# Altium schematic sheet Analog Input Conditioning.SchDoc
size A; SheetNumber: 3; SheetTotal: 7
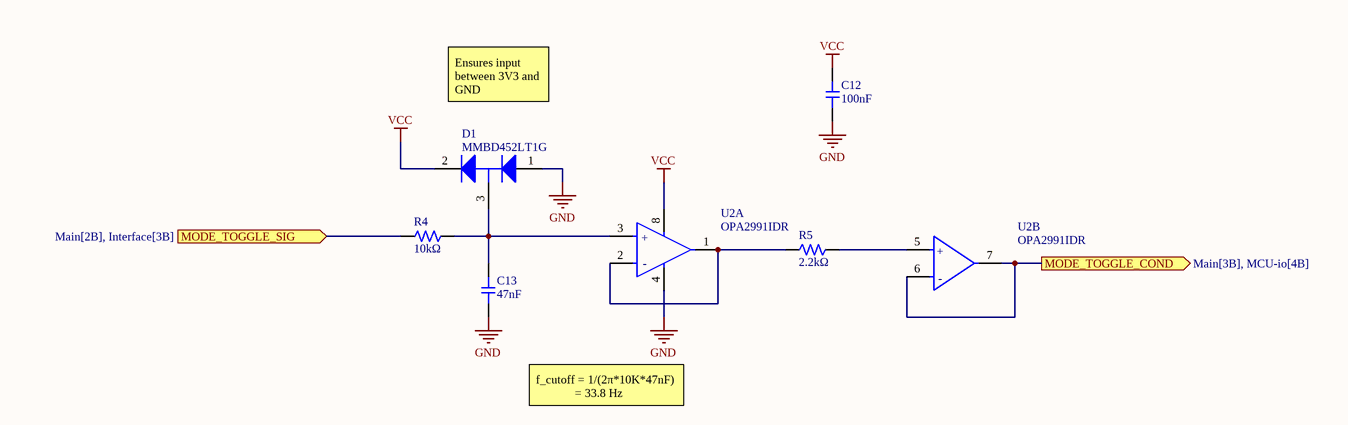
[diagram p0: Analog Input Conditioning.SchDoc]

## Parts
C12  Capacitance: 100nF  [CAP-0603]  (hidden comment: CC0603KRX7R9BB104)
C13  Capacitance: 47nF  [CAP-0603]  (hidden comment: CL10B473KB8NNNC)
D1  MMBD452LT1G  [ONSC-SOT-23-3-318-08_V]
R4  Resistance: 10kΩ  [RES-0603]  (hidden comment: 0603WAF1002T5E)
R5  Resistance: 2.2kΩ  [RES-0603]  (hidden comment: 0603WAF2201T5E)
U2  OPA2991IDR  [FP-D0008A-IPC_C]  (parts A,B of 2)

## Ports
MODE_TOGGLE_COND (out, see Main[3B], MCU-io[4B]), MODE_TOGGLE_SIG (in, see Main[2B], Interface[3B])

## Nets
GND: C12.1 C13.1 D1.1(A) U2.4(V-)
VCC: C12.2 D1.2(K) U2.8(V+)
MODE_TOGGLE_COND: U2.6(IN2-) U2.7(OUT2) ; port MODE_TOGGLE_COND
MODE_TOGGLE_SIG: R4.1 ; port MODE_TOGGLE_SIG
NetC13_2: C13.2 D1.3(K/A) R4.2 U2.3(IN1+)
NetR5_1: R5.1 U2.1(OUT1) U2.2(IN1-)
NetR5_2: R5.2 U2.5(IN2+)

## Notes on the sheet
- Ensures input between 3V3 and GND
- f_cutoff = 1/(2π*10K*47nF)
  = 33.8 Hz
- (in symbol OPA2991IDR, part A) +; -
- (in symbol OPA2991IDR, part B) +; -

## Library data of the parts
C12 = CC0603KRX7R9BB104: Capacitor, Ceramic (MLCC), 100nF, ±10%, 50V, X7R, ±10%, SMD 0603; Manufacturer: YAGEO; Package Size: 0603; JLCPCB Basic Part: Yes; JLCPCB Part Number: C14663; Supplier 1: LCSC; Category: Capacitors - MLCC; Supplier Part Number 1: C14663; Manufacturer Part Number: CC0603KRX7R9BB104; Tolerance: ±10%; Voltage Rating: 50V; Temperature Coefficient: X7R; RoHS: Yes; ComponentLink1Description: Datasheet; ComponentLink1URL: https://wmsc.lcsc.com/wmsc/upload/file/pdf/v2/lcsc/2211101700_YAGEO-CC0603KRX7R9BB104_C14663.pdf; ComponentLink2Description: JLCPCB Part URL; ComponentLink2URL: https://jlcpcb.com/partdetail/C14663; ComponentLink3Description: LCSC Part URL; ComponentLink3URL: https://lcsc.com/product-detail/Multilayer-Ceramic-Capacitors-MLCC---SMD-SMT_YAGEO-YAGEO-CC0603KRX7R9BB104_C14663.html
C13 = CL10B473KB8NNNC: Capacitor, Ceramic (MLCC), 47nF, ±10%, 50V, X7R, ±10%, SMD 0603; Manufacturer: Samsung Electro-Mechanics; Temperature Rating: -55°C ~ 125°C; Capacitance @ 1V DC Bias: 47.231nF; Capacitance @ 1.2V DC Bias: 47.280nF; Capacitance @ 1.35V DC Bias: 47.319nF; Capacitance @ 1.5V DC Bias: 47.357nF; Capacitance @ 1.8V DC Bias: 47.426nF; Capacitance @ 2.5V DC Bias: 47.515nF; Capacitance @ 3.3V DC Bias: 47.532nF; Capacitance @ 3.7V DC Bias: 47.514nF; Capacitance @ 4.2V DC Bias: 47.475nF; Capacitance @ 5V DC Bias: 47.375nF; Capacitance @ 9V DC Bias: 46.446nF; Capacitance @ 12V DC Bias: 45.320nF; Capacitance @ 15V DC Bias: 44.061nF; Capacitance @ 24V DC Bias: 39.258nF; Capacitance @ 36V DC Bias: 31.412nF; Capacitance @ 48V DC Bias: 23.014nF; Impedance (0V Bias) @ 100Hz: 3.3E+04Ω; Impedance (0V Bias) @ 500Hz: 6.73E+03Ω; Impedance (0V Bias) @ 1kHz: 3.4E+03Ω; Impedance (0V Bias) @ 5kHz: 693Ω; Impedance (0V Bias) @ 10kHz: 349Ω; Impedance (0V Bias) @ 50kHz: 71.1Ω; Impedance (0V Bias) @ 100kHz: 35.7Ω; Impedance (0V Bias) @ 500kHz: 7.27Ω; Impedance (0V Bias) @ 1MHz: 3.65Ω; Impedance (0V Bias) @ 5MHz: 0.738Ω; Impedance (0V Bias) @ 10MHz: 0.364Ω; Impedance (0V Bias) @ 50MHz: 0.0607Ω; Impedance (0V Bias) @ 100MHz: 0.192Ω; Impedance (0V Bias) @ 500MHz: 0.928Ω; Impedance (0V Bias) @ 1GHz: 1.81Ω; Impedance (0V Bias) @ 2GHz: 4.68Ω; Impedance (0V Bias) @ 5GHz: 10.5Ω; Package Size: 0603; JLCPCB Basic Part: Yes; JLCPCB Part Number: C1622; Supplier 1: LCSC; Category: Capacitors - MLCC; Supplier Part Number 1: C1622; Manufacturer Part Number: CL10B473KB8NNNC; Tolerance: ±10%; Voltage Rating: 50V; Temperature Coefficient: X7R; RoHS: Yes; ComponentLink1Description: Datasheet; ComponentLink1URL: https://wmsc.lcsc.com/wmsc/upload/file/pdf/v2/lcsc/2304140030_Samsung-Electro-Mechanics-CL10B473KB8NNNC_C1622.pdf; ComponentLink2Description: JLCPCB Part URL; ComponentLink2URL: https://jlcpcb.com/partdetail/C1622; ComponentLink3Description: LCSC Part URL; ComponentLink3URL: https://lcsc.com/product-detail/Multilayer-Ceramic-Capacitors-MLCC---SMD-SMT_Samsung-Electro-Mechanics-Samsung-Electro-Mechanics-CL10B473KB8NNNC_C1622.html; ComponentLink4Description: Samsung Component Library; ComponentLink4URL: https://weblib.samsungsem.com/mlcc/mlcc-ec.do?partNumber=CL10B473KB8NNN
D1 = MMBD452LT1G: 30V SCHOTTKY; Manufacturer: On Semiconductor; Packing: Tape and Reel; Configuration: Dual; ComponentLink2Description: Datasheet; ComponentLink3URL: http://www.onsemi.cn/pub_link/Collateral/318-08.PDF; ComponentLink1URL: http://www.onsemi.com/; Mounting Technology: Surface Mount; ComponentLink3Description: Package Specification; PackageVersion: Rev. AP, 11/2009; PartNumber: MMBD452LT1G; ComponentLink1Description: Manufacturer URL; ComponentLink2URL: http://www.onsemi.cn/pub_link/Collateral/MMBD452LT1-D.PDF; PackageReference: SOT-23-3-318-08; RoHS: TRUE; PackageDescription: 3-Pin Small Outline Transistor, Body 2.92 x 1.3 mm, Pitch 0.95 mm; DatasheetVersion: Rev. 4; Manufacturer: ON Semiconductor; Manufacturer Part Number: MMBD452LT1G
R4 = 0603WAF1002T5E: Resistor, 10kΩ, ±1%, 100mW, 75V, ±100ppm/℃, -55℃~+155℃, SMD 0603; Manufacturer: Uniroyal; Supplier 1: LCSC; Manufacturer Part Number: 0603WAF1002T5E; Supplier Part Number 1: C25804; JLCPCB Part Number: C25804; Power Rating: 100mW; Category: Resistors; Package Size: 0603; JLCPCB Basic Part: Yes; Tolerance: ±1%; Voltage Rating: 75V; Temperature Coefficient: ±100ppm/℃; Temperature Rating: -55℃~+155℃; ComponentLink1Description: Datasheet; ComponentLink1URL: https://wmsc.lcsc.com/wmsc/upload/file/pdf/v2/lcsc/2206010045_UNI-ROYAL-Uniroyal-Elec-0603WAF1002T5E_C25804.pdf; ComponentLink2Description: JLCPCB Part URL; ComponentLink2URL: https://jlcpcb.com/partdetail/C25804
R5 = 0603WAF2201T5E: Resistor, 2.2kΩ, ±1%, 100mW, 75V, ±100ppm/℃, -55℃~+155℃, SMD 0603; Manufacturer: Uniroyal; Supplier 1: LCSC; Manufacturer Part Number: 0603WAF2201T5E; Supplier Part Number 1: C4190; JLCPCB Part Number: C4190; Power Rating: 100mW; Category: Resistors; Package Size: 0603; JLCPCB Basic Part: Yes; Tolerance: ±1%; Voltage Rating: 75V; Temperature Coefficient: ±100ppm/℃; Temperature Rating: -55℃~+155℃; ComponentLink1Description: Datasheet; ComponentLink1URL: https://wmsc.lcsc.com/wmsc/upload/file/pdf/v2/lcsc/2206010230_UNI-ROYAL-Uniroyal-Elec-0603WAF2201T5E_C4190.pdf; ComponentLink2Description: JLCPCB Part URL; ComponentLink2URL: https://jlcpcb.com/partdetail/C4190
U2 = OPA2991IDR: IC OPAMP GP 2 CIRCUIT 8SOIC; Manufacturer: Texas Instruments; Manufacturer Part Number: OPA2991IDR